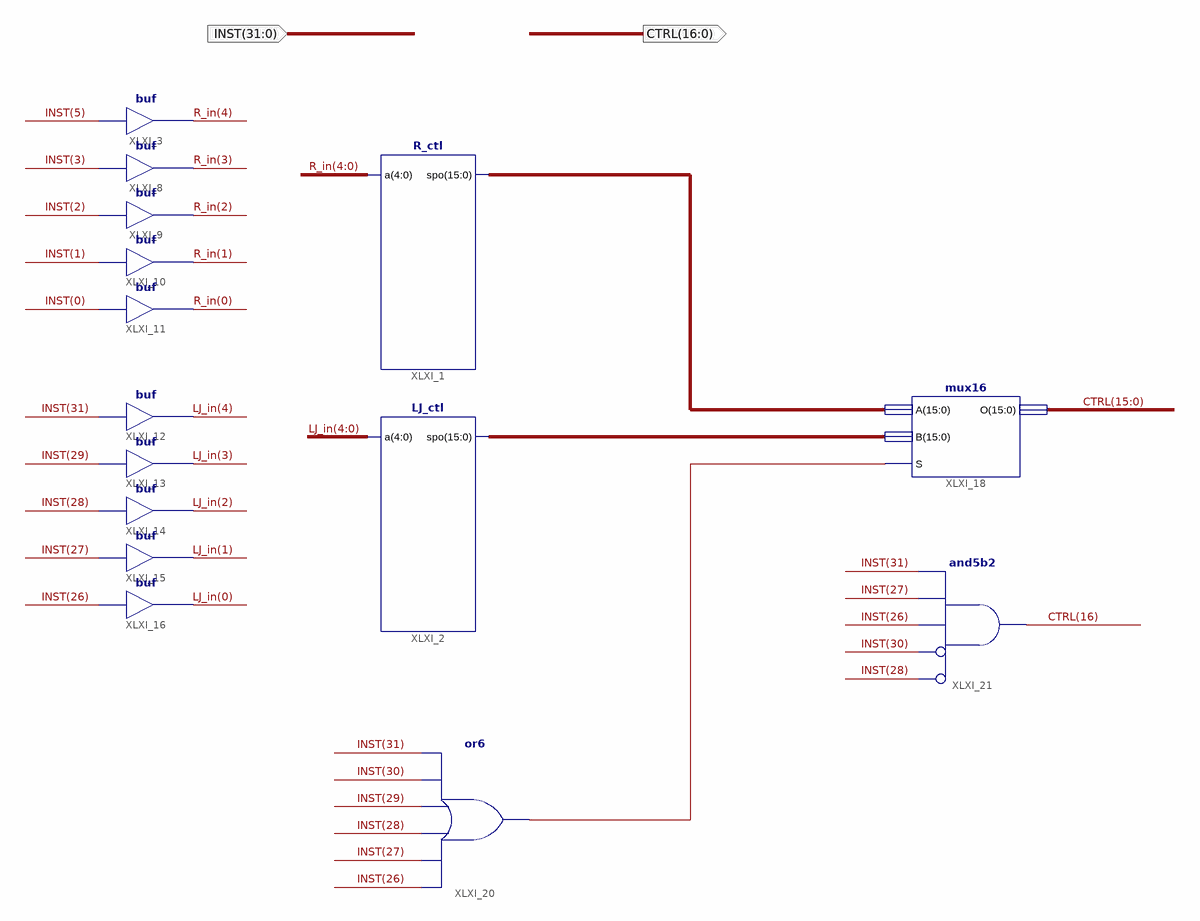
[diagram p0: schematic sheet 1]
// Xilinx ISE schematic Inst_Ctl.sch (artix7) as structural Verilog: 15 symbols, 3 ports
module Inst_Ctl (
  input  [31:0] INST,
  output [16:0] CTRL
);

  wire XLXN_29;
  wire [4:0] LJ_in, R_in;
  wire [15:0] XLXN_30, XLXN_31;

  R_ctl XLXI_1 (.a(R_in), .spo(XLXN_31));
  LJ_ctl XLXI_2 (.a(LJ_in), .spo(XLXN_30));
  buf XLXI_3 (R_in[4], INST[5]);
  buf XLXI_8 (R_in[3], INST[3]);
  buf XLXI_9 (R_in[2], INST[2]);
  buf XLXI_10 (R_in[1], INST[1]);
  buf XLXI_11 (R_in[0], INST[0]);
  buf XLXI_12 (LJ_in[4], INST[31]);
  buf XLXI_13 (LJ_in[3], INST[29]);
  buf XLXI_14 (LJ_in[2], INST[28]);
  buf XLXI_15 (LJ_in[1], INST[27]);
  buf XLXI_16 (LJ_in[0], INST[26]);
  mux16 XLXI_18 (.A(XLXN_31), .B(XLXN_30), .O(CTRL[15:0]), .S(XLXN_29));
  or XLXI_20 (XLXN_29, INST[26], INST[27], INST[28], INST[29], INST[30], INST[31]);
  and XLXI_21 (CTRL[16], ~INST[28], ~INST[30], INST[26], INST[27], INST[31]);  // and5b2
endmodule
